# Altium schematic sheet ADS1274.SchDoc
size A4
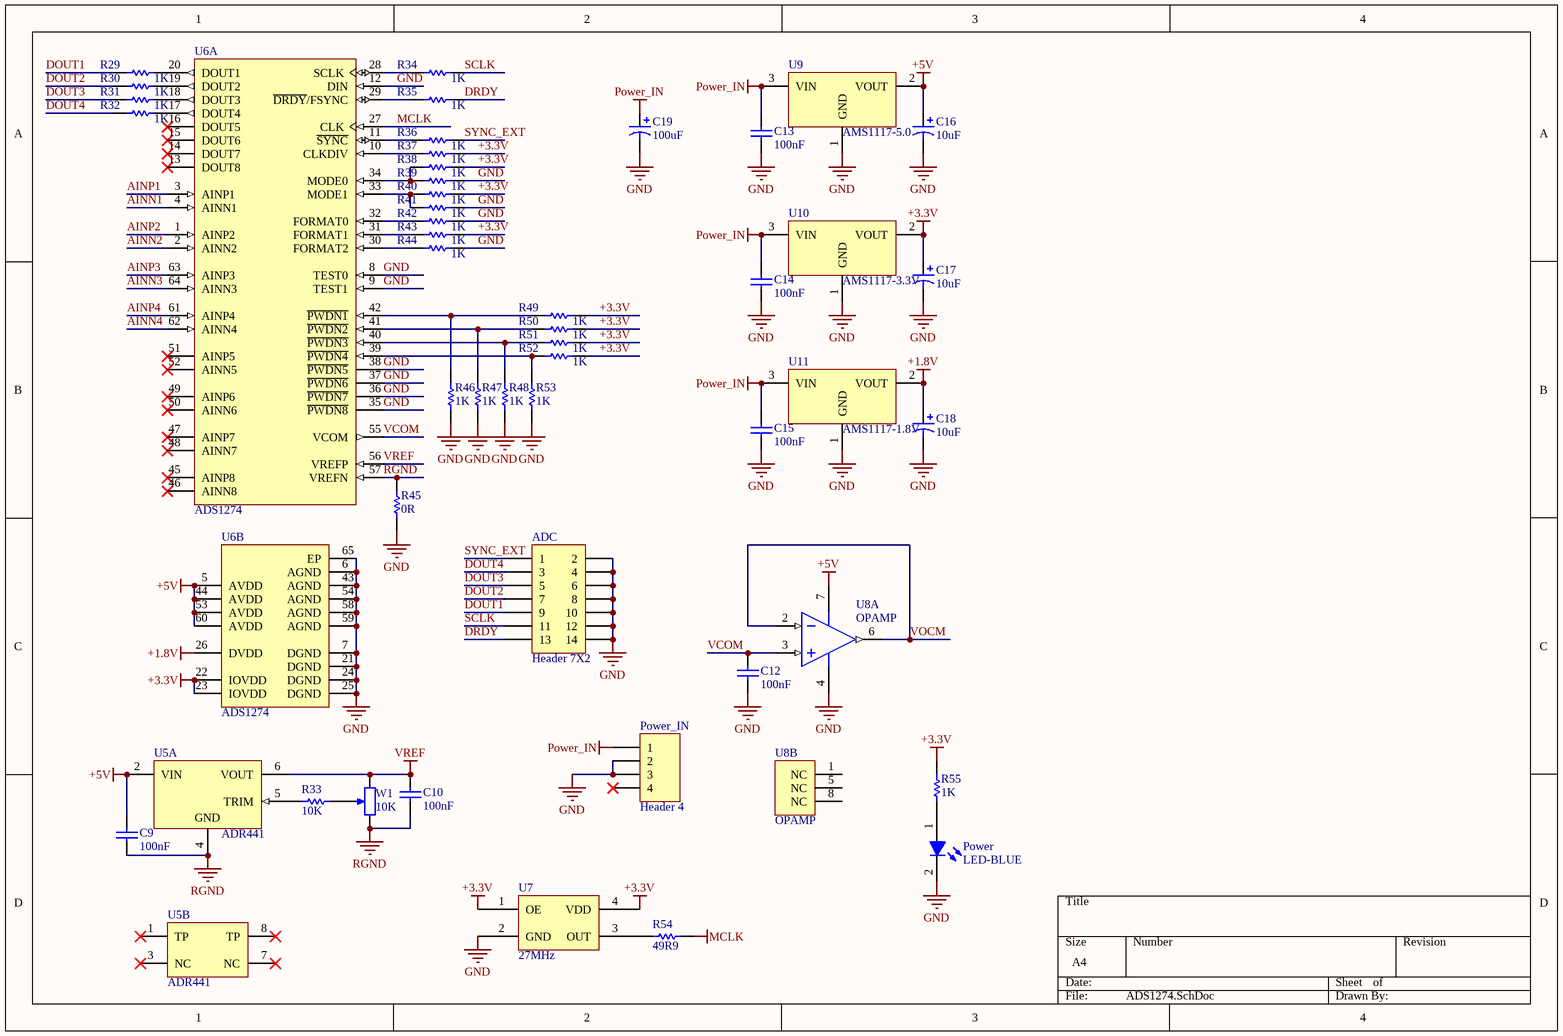
[diagram p0: ADS1274.SchDoc]

## Parts
ADC  Header 7X2  [HEADER7X2]
C9  100nF  [CAPC0603(1608)55_M]
C10  100nF  [CAPC0603(1608)55_M]
C12  100nF  [CAPC0603(1608)55_M]
C13  100nF  [CAPC0603(1608)55_M]
C14  100nF  [CAPC0603(1608)55_M]
C15  100nF  [CAPC0603(1608)55_M]
C16  10uF  [CAPC3528]
C17  10uF  [CAPC3528]
C18  10uF  [CAPC3528]
C19  100uF  [CAPC7343]
Power  LED-BLUE  [0603LED_BLUE_V]
Power_IN  Header 4  [3.96-4]
R29  1K  [RESC0603(1608)_M]
R30  1K  [RESC0603(1608)_M]
R31  1K  [RESC0603(1608)_M]
R32  1K  [RESC0603(1608)_M]
R33  10K  [RESC0603(1608)_M]
R34  1K  [RESC0603(1608)_M]
R35  1K  [RESC0603(1608)_M]
R36  1K  [RESC0603(1608)_M]
R37  1K  [RESC0603(1608)_M]
R38  1K  [RESC0603(1608)_M]
R39  1K  [RESC0603(1608)_M]
R40  1K  [RESC0603(1608)_M]
R41  1K  [RESC0603(1608)_M]
R42  1K  [RESC0603(1608)_M]
R43  1K  [RESC0603(1608)_M]
R44  1K  [RESC0603(1608)_M]
R45  0R  [RESC0603(1608)_M]
R46  1K  [RESC0603(1608)_M]
R47  1K  [RESC0603(1608)_M]
R48  1K  [RESC0603(1608)_M]
R49  1K  [RESC0603(1608)_M]
R50  1K  [RESC0603(1608)_M]
R51  1K  [RESC0603(1608)_M]
R52  1K  [RESC0603(1608)_M]
R53  1K  [RESC0603(1608)_M]
R54  49R9  [RESC0603(1608)_M]
R55  1K  [RESC0603(1608)_M]
U5  ADR441  [SOIC8]  (parts A,B of 2)
U6  ADS1274  [EQFP64]  (parts A,B of 2)
U7  27MHz  [SMD7050]
U8  OPAMP  [SOIC8]  (parts A,B of 2)
U9  AMS1117-5.0  [SOT-223_M]
U10  AMS1117-3.3V  [SOT-223_M]
U11  AMS1117-1.8V  [SOT-223_M]
W1  10K  [VR5]

## Nets
+1.8V: C18.1 U6.26(DVDD) U11.2(VOUT)
+3.3V: C17.1 R37.2 R38.2 R40.2 R43.2 R49.2 R50.2 R51.2 R52.2 R55.2 U6.22(IOVDD) U6.23(IOVDD) U7.1(OE) U7.4(VDD) U10.2(VOUT)
+5V: C9.2 C16.1 U5.2(VIN) U6.5(AVDD) U6.44(AVDD) U6.53(AVDD) U6.60(AVDD) U8.7(V+) U9.2(VOUT)
GND: ADC.2 ADC.4 ADC.6 ADC.8 ADC.10 ADC.12 ADC.14 C12.1 C13.1 C14.1 C15.1 C16.2 C17.2 C18.2 C19.2 Power.2(K) Power_IN.2 Power_IN.3 R39.2 R41.2 R42.2 R44.2 R45.1 R46.1 R47.1 R48.1 R53.1 U6.6(AGND) U6.7(DGND) U6.8(TEST0) U6.9(TEST1) U6.12(DIN) U6.21(DGND) U6.24(DGND) U6.25(DGND) U6.35(~{PWDN8}) U6.36(~{PWDN7}) U6.37(~{PWDN6}) U6.38(~{PWDN5}) U6.43(AGND) U6.54(AGND) U6.58(AGND) U6.59(AGND) U6.65(EP) U7.2(GND) U8.4(V-) U9.1(GND) U10.1(GND) U11.1(GND)
MCLK: R54.2 U6.27(CLK)
Power_IN: C13.2 C14.2 C15.2 C19.1 Power_IN.1 U9.3(VIN) U10.3(VIN) U11.3(VIN)
RGND: C9.1 C10.1 R45.2 U5.4(GND) U6.57(VREFN) W1.3(BOT)
VREF: C10.2 U5.6(VOUT) U6.56(VREFP) W1.1(TOP)
AINN1: U6.4(AINN1)
AINN2: U6.2(AINN2)
AINN3: U6.64(AINN3)
AINN4: U6.62(AINN4)
AINP1: U6.3(AINP1)
AINP2: U6.1(AINP2)
AINP3: U6.63(AINP3)
AINP4: U6.61(AINP4)
DOUT1: ADC.9 R29.1
DOUT2: ADC.7 R30.1
DOUT3: ADC.5 R31.1
DOUT4: ADC.3 R32.1
DRDY: ADC.13 R35.2
SCLK: ADC.11 R34.2
SYNC_EXT: ADC.1 R36.2
VCOM: C12.2 U6.55(VCOM) U8.3(IN+)
VOCM: U8.2(IN-) U8.6(OUT)
NetPower_1: Power.1(A) R55.1
NetR29_2: R29.2 U6.20(DOUT1)
NetR30_2: R30.2 U6.19(DOUT2)
NetR31_2: R31.2 U6.18(DOUT3)
NetR32_2: R32.2 U6.17(DOUT4)
NetR33_1: R33.1 U5.5(TRIM)
NetR33_2: R33.2 W1.2(TAP)
NetR34_1: R34.1 U6.28(SCLK)
NetR35_1: R35.1 U6.29(~{DRDY}/FSYNC)
NetR36_1: R36.1 U6.11(~{SYNC})
NetR37_1: R37.1 U6.10(CLKDIV)
NetR38_1: R38.1 R39.1 U6.34(MODE0)
NetR40_1: R40.1 R41.1 U6.33(MODE1)
NetR42_1: R42.1 U6.32(FORMAT0)
NetR43_1: R43.1 U6.31(FORMAT1)
NetR44_1: R44.1 U6.30(FORMAT2)
NetR46_2: R46.2 R49.1 U6.42(~{PWDN1})
NetR47_2: R47.2 R50.1 U6.41(~{PWDN2})
NetR48_2: R48.2 R51.1 U6.40(~{PWDN3})
NetR52_1: R52.1 R53.2 U6.39(~{PWDN4})
NetR54_1: R54.1 U7.3(OUT)

Not connected (* = marked no-connect by the designer): Power_IN 4*; U5 1(TP)* 3(NC)* 7(NC)* 8(TP)*; U6 13(DOUT8)* 14(DOUT7)* 15(DOUT6)* 16(DOUT5)* 45(AINP8)* 46(AINN8)* 47(AINP7)* 48(AINN7)* 49(AINP6)* 50(AINN6)* 51(AINP5)* 52(AINN5)*; U8 1(NC) 5(NC) 8(NC)

## Library data of the parts
ADC = Header 7X2: Header, 7-Pin, Dual row; LatestRevisionDate: 17-Jul-2002; LatestRevisionNote: Re-released for DXP Platform.; Publisher: Altium Limited
C9 C10 C12-C15 = CAP
C16-C19 = CAP-Pol
Power_IN = Header 4: Header, 4-Pin; LatestRevisionDate: 17-Jul-2002; LatestRevisionNote: Re-released for DXP Platform.; Publisher: Altium Limited
R29-R55 = RES
U5 = ADR421
U7 = OSC7050
U9-U11 = AMS1117
W1 = RPot2: Potentiometer; Manufacturer: Generic Components; Class: Passive; Set Position: 0.5; Value: 1K; Published: 08/06/2000; Publisher: Altium Hobart Technology Centre; SubClass: Potentiometer